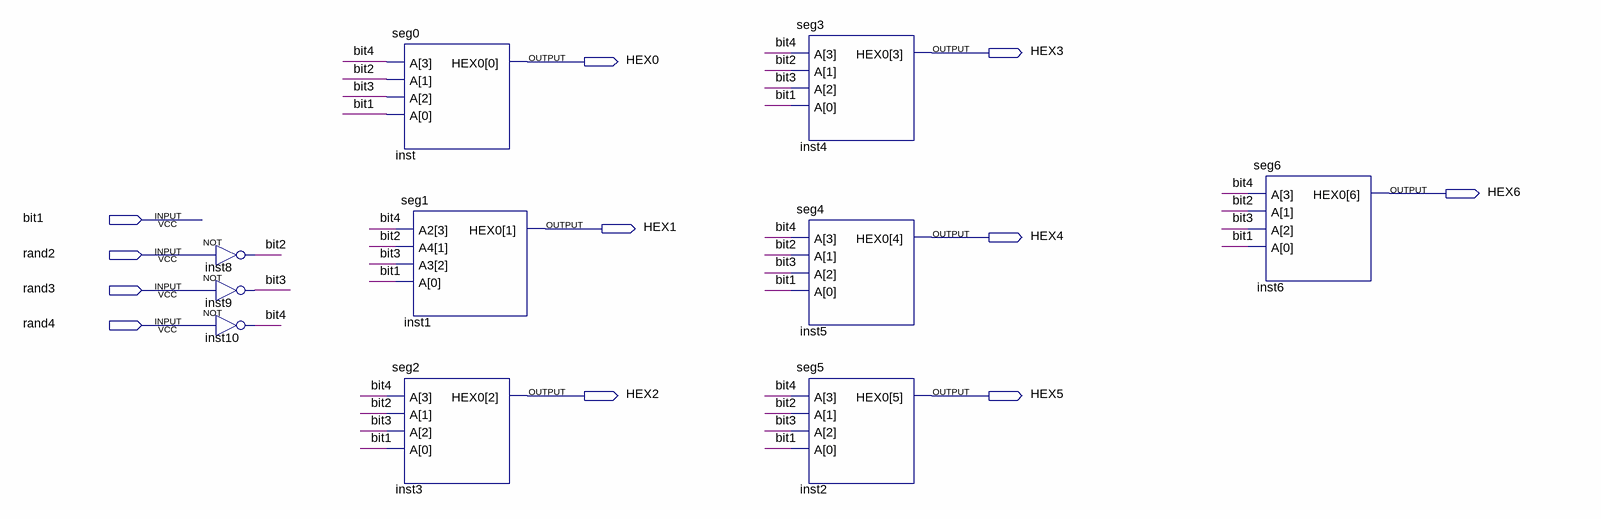
[diagram p0: schematic sheet]
// Quartus schematic segmentDisplay.bdf as structural Verilog: 10 symbols, 11 pins
module segmentDisplay (
  input  bit1,
  input  rand2,
  input  rand3,
  input  rand4,
  output HEX3,
  output HEX0,
  output HEX6,
  output HEX1,
  output HEX4,
  output HEX2,
  output HEX5
);

  wire bit2, bit3, bit4;

  not inst8 (bit2, rand2);
  not inst9 (bit3, rand3);
  not inst10 (bit4, rand4);
  seg0 inst (.A({bit4, bit3, bit2, bit1}), .HEX0(HEX0));
  seg1 inst1 (.A2(bit4), .A4(bit2), .A3(bit3), .A(bit1), .HEX0(HEX1));
  seg2 inst3 (.A({bit4, bit3, bit2, bit1}), .HEX0(HEX2));
  seg3 inst4 (.A({bit4, bit3, bit2, bit1}), .HEX0(HEX3));
  seg4 inst5 (.A({bit4, bit3, bit2, bit1}), .HEX0(HEX4));
  seg5 inst2 (.A({bit4, bit3, bit2, bit1}), .HEX0(HEX5));
  seg6 inst6 (.A({bit4, bit3, bit2, bit1}), .HEX0(HEX6));
endmodule
